# EAGLE design radioboard (EAGLE 8.1.0)
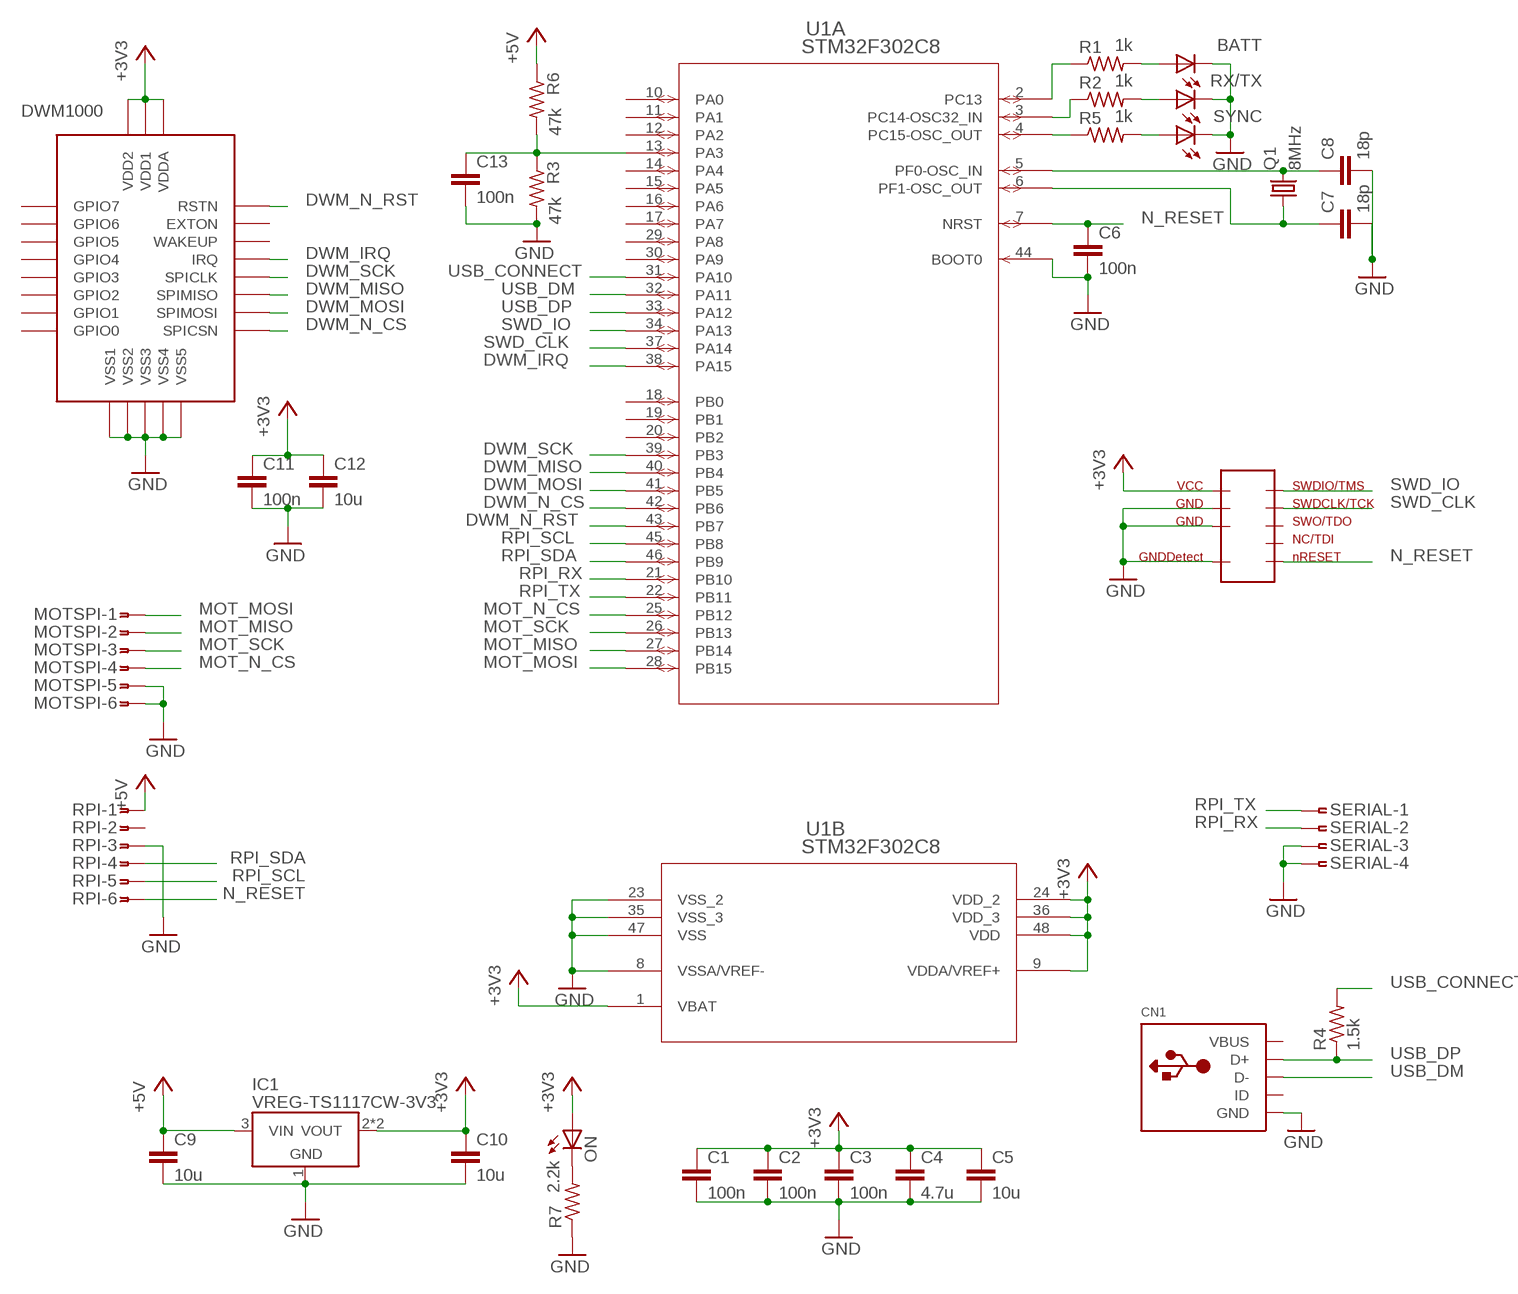
[diagram p0: schematic, sheet 1]

## Parts
BATT  LEDCHIPLED_0805  [CHIPLED_0805]
C1  100n  C-EUC0805  [C0805]
C2  100n  C-EUC0805  [C0805]
C3  100n  C-EUC0805  [C0805]
C4  4.7u  C-EUC0805  [C0805]
C5  10u  C-EUC0805  [C0805]
C6  100n  C-EUC0805  [C0805]
C7  18p  C-EUC0805  [C0805]
C8  18p  C-EUC0805  [C0805]
C9  10u  C-EUC0805  [C0805]
C10  10u  C-EUC0805  [C0805]
C11  100n  C-EUC0805  [C0805]
C12  10u  C-EUC0805  [C0805]
C13  100n  C-EUC0805  [C0805]
CN1  USBMINIB  [USB-MINIB]
DWM1000  DWM1000  [DW1000-PACKAGE]
IC1  VREG-TS1117CW-3V3  [SOT223]
MOTSPI  SMDTOP-6  [SMDTOP6]
ON  LEDCHIPLED_0805  [CHIPLED_0805]
Q1  8MHz  CRYSTALSM49  [SM49]
R1  1k  R-US_M0805  [M0805]
R2  1k  R-US_M0805  [M0805]
R3  47k  R-US_M0805  [M0805]
R4  1.5k  R-US_M0805  [M0805]
R5  1k  R-US_M0805  [M0805]
R6  47k  R-US_M0805  [M0805]
R7  2.2k  R-US_M0805  [M0805]
RPI  SMDTOP-6  [SMDTOP6]
RX/TX  LEDCHIPLED_0805  [CHIPLED_0805]
SERIAL  SMDTOP-4  [SMDTOP4]
SYNC  LEDCHIPLED_0805  [CHIPLED_0805]
U1  STM32F302C8  STM32F302_303C2  [LQFP48-7X7MM]
U$1  SWD/JTAG-_PINS  [SAMTEC_SHF-105-01-L-D-SM]

## Nets
+3V3: C1.1 C2.1 C3.1 C4.1 C5.1 C10.1 C11.1 C12.1 DWM1000.VDD3V3(VDD1) DWM1000.VDD3V32(VDD2) DWM1000.VDDAON(VDDA) IC1.2(VOUT) IC1.4(VOUT) ON.A U1.1(B:VBAT) U1.9(B:VDDA/VREF+) U1.24(B:VDD_2) U1.36(B:VDD_3) U1.48(B:VDD) U$1.P$1
+5V: C9.1 IC1.3(VIN) R6.1 RPI.1
DWM_IRQ: DWM1000.IRQ U1.38(A:PA15)
DWM_MISO: DWM1000.SPIMISO U1.40(A:PB4)
DWM_MOSI: DWM1000.SPIMOSI U1.41(A:PB5)
DWM_N_CS: DWM1000.SPICSN U1.42(A:PB6)
DWM_N_RST: DWM1000.RSTN U1.43(A:PB7)
DWM_SCK: DWM1000.SPICLK U1.39(A:PB3)
GND: BATT.C C1.2 C2.2 C3.2 C4.2 C5.2 C6.2 C7.2 C8.2 C9.2 C10.2 C11.2 C12.2 C13.2 CN1.GND DWM1000.VSS1 DWM1000.VSS2 DWM1000.VSS3 DWM1000.VSS4 DWM1000.VSS5 IC1.1(GND) MOTSPI.5 MOTSPI.6 R3.2 R7.1 RPI.3 RX/TX.C SERIAL.3 SERIAL.4 SYNC.C U1.8(B:VSSA/VREF-) U1.23(B:VSS_2) U1.35(B:VSS_3) U1.44(A:BOOT0) U1.47(B:VSS) U$1.P$3 U$1.P$5 U$1.P$9
MOT_MISO: MOTSPI.2 U1.27(A:PB14)
MOT_MOSI: MOTSPI.1 U1.28(A:PB15)
MOT_N_CS: MOTSPI.4 U1.25(A:PB12)
MOT_SCK: MOTSPI.3 U1.26(A:PB13)
N$1: R1.1 U1.2(A:PC13)
N$2: C7.1 Q1.1 U1.6(A:PF1-OSC_OUT)
N$3: C8.1 Q1.2 U1.5(A:PF0-OSC_IN)
N$4: R2.1 U1.3(A:PC14-OSC32_IN)
N$5: R5.1 U1.4(A:PC15-OSC_OUT)
N$6: BATT.A R1.2
N$7: R2.2 RX/TX.A
N$8: C13.1 R3.1 R6.2 U1.13(A:PA3)
N$9: ON.C R7.2
N$10: R5.2 SYNC.A
N_RESET: C6.1 RPI.6 U1.7(A:NRST) U$1.P$10
RPI_RX: SERIAL.2 U1.21(A:PB10)
RPI_SCL: RPI.5 U1.45(A:PB8)
RPI_SDA: RPI.4 U1.46(A:PB9)
RPI_TX: SERIAL.1 U1.22(A:PB11)
SWD_CLK: U1.37(A:PA14) U$1.P$4
SWD_IO: U1.34(A:PA13) U$1.P$2
USB_CONNECT: R4.2 U1.31(A:PA10)
USB_DM: CN1.D- U1.32(A:PA11)
USB_DP: CN1.D+ R4.1 U1.33(A:PA12)
Unconnected: CN1.ID DWM1000.EXTON DWM1000.GPIO0 DWM1000.GPIO1 DWM1000.GPIO2 DWM1000.GPIO3 DWM1000.GPIO4 DWM1000.GPIO5 DWM1000.GPIO6 DWM1000.GPIO7 DWM1000.WAKEUP RPI.2 U1.10(A:PA0) U1.11(A:PA1) U1.12(A:PA2) U1.14(A:PA4) U1.15(A:PA5) U1.16(A:PA6) U1.17(A:PA7) U1.18(A:PB0) U1.19(A:PB1) U1.20(A:PB2) U1.29(A:PA8) U1.30(A:PA9) U$1.P$6 U$1.P$8

## Power pins joined to a net without a drawn wire
VBUS: CN1.VBUS

## Library data of the parts
BATT ON RX/TX SYNC = misc:LED: LED OSRAM: - CHIPLED LG R971, LG N971, LY N971, LG Q971, LY Q971, LO R971, LY R971 LH N974, LH R974 LS Q976, LO Q976, LY Q976 LO Q996 - Hyper CHIPLED LW Q18S LB Q993, LB Q99A, LB R99A - SideLED LS A670, LO A670, LY A670, LG A670, LP A670 LB A673, LV A673, LT A673, LW A673 LH A674 LY A675 LS A676, LA A676, LO A676, LY A676, LW A676 LS A679, LY A679, LG A679 - Hyper Micro SIDELED® LS Y876, LA Y876, LO Y876, LY Y876 LT Y87S - SmartLED LW L88C, LW L88S LB L89C, LB L89S, LG L890 LS L89K, LO L89K, LY L89K LS L896, LA L896, LO L896, LY L896 - TOPLED LS T670, LO T670, LY T670, LG T670, LP T670 LSG T670, LSP T670, LSY T670, LOP T670, LYG T670 LG T671, LOG T671, LSG T671 LB T673, LV T673, LT T673, LW T673 LH T674 LS T676, LA T676, LO T676, LY T676, LB T676, LH T676, LSB T676, LW T676 LB T67C, LV T67C, LT T67C, LS T67K, LO T67K, LY T67K, LW E67C LS E67B, LA E67B, LO E67B, LY E67B, LB E67C, LV E67C, LT E67C LW T67C LS T679, LY T679, LG T679 LS T770, LO T770, LY T770, LG T770, LP T770 LB T773, LV T773, LT T773, LW T773 LH T774 LS E675, LA E675, LY E675, LS T675 LS T776, LA T776, LO T776, LY T776, LB T776 LHGB T686 LT T68C, LB T68C - Hyper Mini TOPLED® LB M676 - Mini TOPLED Santana® LG M470 LS M47K, LO M47K, LY M47K Source: http://www.osram.convergy.de/
C1-C13 = rcl:C-EU: CAPACITOR, European symbol
CN1 = misc:USB: USB Connectors USBMINIB - Surface Mount Female Mini-B USB Connector 4UConnector: 06564 By microbuilder.eu Thru-hole RA Female Mini-B USB Connector 4UConnector: 18732 By ladyada.net
DWM1000 = DWM1000:DWM1000
IC1 = we-power:VREG: Voltage Regulators (LDOs, Switching Converters...) LDOs Taiwan Semi TS1117 800mA max 15V - compatible On Semi NCP1117 1A max 20V - compatible Diodes AP2111H 0.6A max 6V (0.25V@0.6A) - compatible Diodes AP2114H 1A max 6V (0.45V@1A) Taiwan Semi TS9011 250mA max 12V - compatible Diodes AP2210 300mA max 15V - compatible Microchip MCP1700 250mA max 6.5V - compatible Microchip MCP1702 250mA max 13V - compatible Microchip MCP1703 250mA max 16V - compatible Microchip MCP1754 150mA max 16V Taiwan Semi TS5204 150mA max 16V (low noise) DC/DC Converter Modules Recom R-78Ex.x-1.0-W36 1A max 28V - compatible CUI V78xx-2000 2A max 18V Murata OKI-78SR-x.x/1.5-W36 1.5A max 36V
MOTSPI RPI = con-amp:SMDTOP-6: AMP connector
Q1 = crystal:CRYSTAL: CRYSTAL; OC_FARNELL: unknown; OC_NEWARK: unknown
R1-R7 = rcl:R-US_: RESISTOR, American symbol
SERIAL = con-amp:SMDTOP-4: AMP connector
U1 = STM32F3xx:STM32F302_303C2; COPYRIGHT: Copyright C 2016 Accelerated Designs. All rights reserved; MANUFACTURER_PART_NUMBER: stm32f302_303c2; VENDOR: STMicroelectronics
U$1 = con-SWD:SWD/JTAG-_PINS

## Board
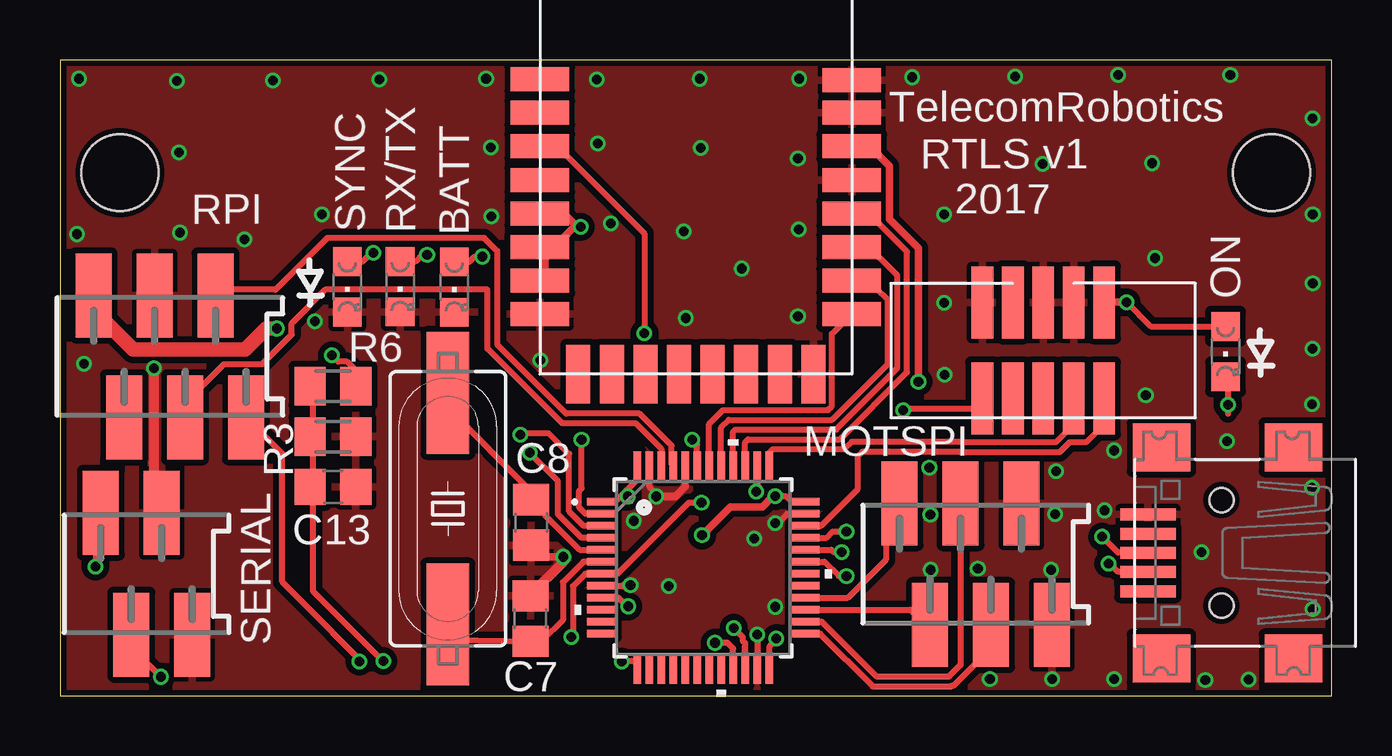
[diagram p1: board, top side]
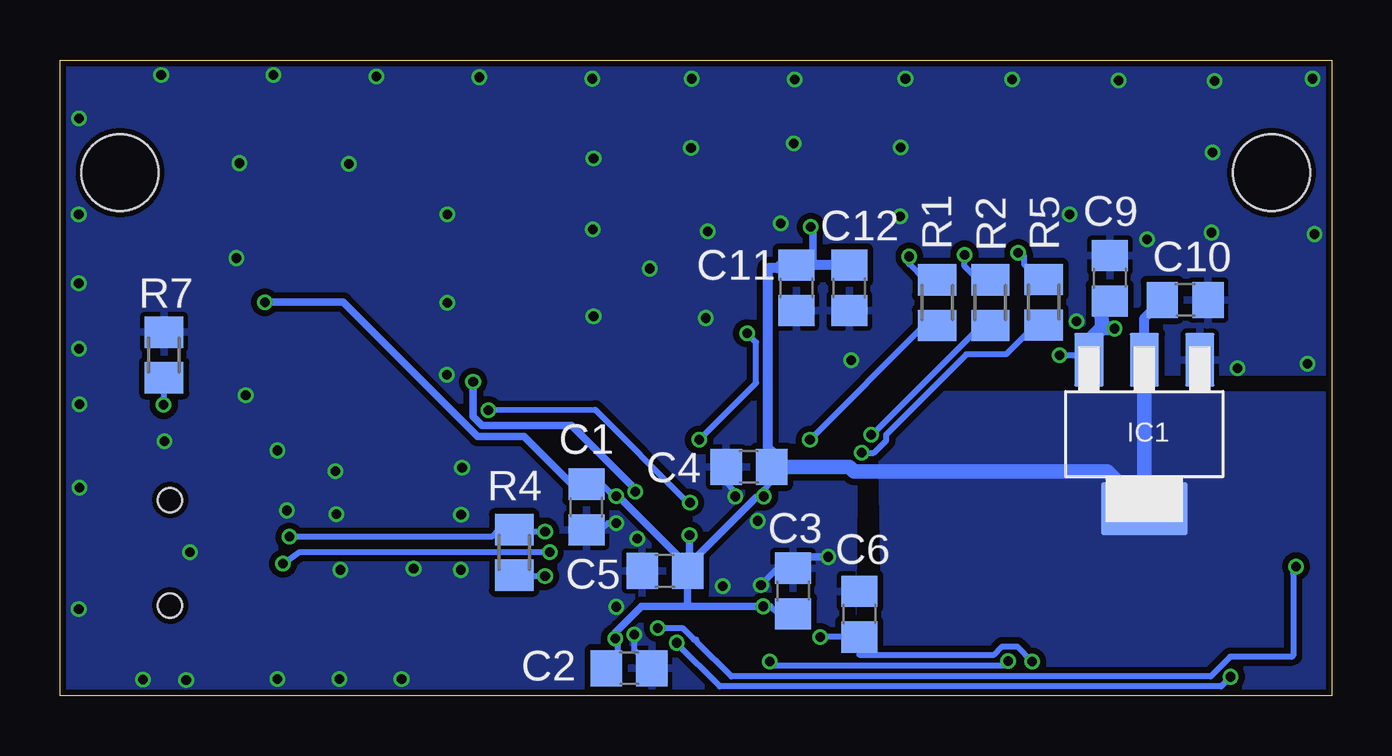
[diagram p2: board, bottom side, seen from below]

Size 53 x 26.5 mm. Coordinates in mm from the lower left corner, seen from the top.
Outline: 0,0 53,0 53,26.5 0,26.5 0,0
Copper layers (1*16): Top 0.018mm / dielectric 1.55mm / Bottom 0.018mm
Design rules "eurocircuit": minimum track width 0.15mm, minimum drill 0.35mm, track to track 0.15mm, track to pad 0.15mm, pad to pad 0.15mm, via to via 0.15mm, smd to smd 0mil, copper to edge 0.25mm, drill to drill 0.35mm, minimum pad ring 0.175mm, minimum via ring 0.125mm, stop-mask expansion 0mil, vias tented up to drill 0.45mm, thermal gap 0.2mm
Holes 3.2 mm at 2.5,21.8 50.5,21.8

### Footprints (pad centres in the part's own frame; a part is rotated, then mirrored left to right if it is on the bottom)
CHIPLED_0805 = smd 1.2 x 1.2: A 0,-1.05; C 0,1.05
C0805 = smd 1.3 x 1.5: 1 -0.95,0; 2 0.95,0
USB-MINIB = smd 0.5 x 2.308: D+ 0,4.064; D- -0.8,4.064; GND 1.6,4.064; ID 0.8,4.064; VBUS -1.6,4.064 | smd 2 x 2.4: GND1 -4.4,-2; GND2 -4.4,3.5; GND3 4.4,3.5; GND4 4.4,-2 | hole 1: -2.2,1; 2.2,1
DW1000-PACKAGE = smd 2.45 x 1: EXTON -6.5,-0.7; GPIO7 -6.5,-4.9; IRQ 6.5,-3.5; RSTN -6.5,-3.5; SPICLK 6.5,-6.3; SPICSN 6.5,-10.5; SPIMISO 6.5,-7.7; SPIMOSI 6.5,-9.1; VDD3V3 -6.5,-7.7; VDD3V32 -6.5,-9.1; VDDAON -6.5,-6.3; VSS1 -6.5,-10.5; VSS3 6.5,-4.9; VSS4 6.5,-2.1; VSS5 6.5,-0.75; WAKEUP -6.5,-2.1 | smd 1 x 2.45: GPIO0 3.5,-13; GPIO1 2.1,-13; GPIO2 0.7,-13; GPIO3 -0.7,-13; GPIO4 -2.1,-13; GPIO5 -3.5,-13; GPIO6 -4.9,-13; VSS2 4.9,-13
SOT223 = smd 2.235 x 1.219: 1 -3.099,2.311; 2 -3.099,0; 3 -3.099,-2.311 | smd 2.2 x 3.6: 4 3.099,0
SMDTOP6 = smd 1.5 x 3.5: 1 -3.175,2.54; 2 -1.905,-2.54; 3 -0.635,2.54; 4 0.635,-2.54; 5 1.905,2.54; 6 3.175,-2.54
SM49 = smd 5.08 x 1.778: 1 -4.826,0; 2 4.826,0
M0805 = smd 1.3 x 1.6: 1 -0.95,0; 2 0.95,0
SMDTOP4 = smd 1.5 x 3.5: 1 -1.905,2.54; 2 -0.635,-2.54; 3 0.635,2.54; 4 1.905,-2.54
LQFP48-7X7MM = smd 1.194 x 0.305: 1 -4.25,2.75; 2 -4.25,2.25; 3 -4.25,1.75; 4 -4.25,1.25; 5 -4.25,0.75; 6 -4.25,0.25; 7 -4.25,-0.25; 8 -4.25,-0.75; 9 -4.25,-1.25; 10 -4.25,-1.75; 11 -4.25,-2.25; 12 -4.25,-2.75; 25 4.25,-2.75; 26 4.25,-2.25; 27 4.25,-1.75; 28 4.25,-1.25; 29 4.25,-0.75; 30 4.25,-0.25; 31 4.25,0.25; 32 4.25,0.75; 33 4.25,1.25; 34 4.25,1.75; 35 4.25,2.25; 36 4.25,2.75 | smd 0.305 x 1.194: 13 -2.75,-4.25; 14 -2.25,-4.25; 15 -1.75,-4.25; 16 -1.25,-4.25; 17 -0.75,-4.25; 18 -0.25,-4.25; 19 0.25,-4.25; 20 0.75,-4.25; 21 1.25,-4.25; 22 1.75,-4.25; 23 2.25,-4.25; 24 2.75,-4.25; 37 2.75,4.25; 38 2.25,4.25; 39 1.75,4.25; 40 1.25,4.25; 41 0.75,4.25; 42 0.25,4.25; 43 -0.25,4.25; 44 -0.75,4.25; 45 -1.25,4.25; 46 -1.75,4.25; 47 -2.25,4.25; 48 -2.75,4.25
SAMTEC_SHF-105-01-L-D-SM = smd 3 x 0.914: P$1 -2,2.54; P$2 2,2.54; P$3 -2,1.27; P$4 2,1.27; P$5 -2,0; P$6 2,0; P$7 -2,-1.27; P$8 2,-1.27; P$9 -2,-2.54; P$10 2,-2.54

### Placement (x,y rotation side)
BATT  16.44,17.03 180 top
C1  31.06,7.86 270 bottom
C2  29.28,1.14 0 bottom
C3  22.44,4.36 90 bottom
C4  24.28,9.54 180 bottom
C5  27.78,5.2 180 bottom
C6  19.68,3.39 90 bottom
C7  19.61,3.21 90 top
C8  19.64,7.22 270 top
C9  9.24,17.4 90 bottom
C10  6.1,16.5 0 bottom
C11  22.3,17 270 bottom
C12  20.1,17 270 bottom
C13  11.38,8.7 0 top
CN1  49.41,5.95 90 top
DWM1000  26.5,26.4 0 top
IC1  7.8,10.9 270 bottom
MOTSPI  38.17,5.48 0 top
ON  48.58,14.34 180 top
Q1  16.17,7.79 90 top
R1  16.44,16.38 90 bottom
R2  14.22,16.38 90 bottom
R3  11.38,10.8 0 top
R4  34.07,5.97 270 bottom
R5  12,16.4 90 bottom
R6  11.38,12.9 180 top
R7  48.66,14.2 270 bottom
RPI  4.58,14.14 0 top
RX/TX  14.18,17.05 180 top
SERIAL  3.61,5.08 0 top
SYNC  11.98,17.04 180 top
U1  26.81,5.33 0 top
U$1  40.98,14.39 270 top

### Tracks (layer width: path | path; a pad name or v marks a point on that pad's centre or on a via)
+3V3  (via drill 0.4)
  Top 0.254: U1.36 30.5,8.08 30.26,8.32 v29.82,8.32 | U1.24 29.58,1.56 29.58,2.06 v29.86,2.38 | U1.9 23.28,4.08 23.64,3.72 v23.68,3.72 | U1.1 23.16,8.08 23.52,8.44 | 23.52,8.44 24.06,8.98 U1.48 | v23.66,8.3 23.52,8.44 | v44.46,16.4 45.47,15.39 ON.A
  Top 0.305: DWM1000.VDDAON 21.02,20.1 21.58,19.54 v21.7,19.54 21.4,19.52 20.58,18.7 DWM1000.VDD3V3 20.22,18.56 20.22,17.32 20.2,17.3 DWM1000.VDD3V32 | v44.46,16.4 U$1.P$1 | v26.76,6.68 27.95,7.87 29.28,7.87 29.73,8.32 v29.82,8.32
  Bottom 0.254: v29.82,8.32 29.92,8.32 30.42,8.82 C1.1 | v29.86,2.38 29.74,2.28 29.74,1.56 C2.1 | v23.68,3.72 23.38,3.72 23.08,3.42 C3.1 | v23.66,8.3 23.66,8.58 23.34,8.9 C4.1
  Bottom 0.305: v29.86,2.38 29.87,2.61 29.69,2.8 28.77,3.72 26.84,3.72 | v23.68,3.72 26.84,3.72 | C11.1 21.62,18.16 21.62,19.54 v21.7,19.54 | v44.46,16.4 41.2,16.4 35.6,10.8 33.66,10.8 31.68,8.82 31.18,8.82 C1.1 | 26.84,3.72 C5.1 | v29.82,8.32 29.7,8.28 27.14,5.72 26.86,5.72 26.84,5.7 26.84,5.34 C5.1 | v23.66,8.3 23.78,8.26 24,8.26 26.5,5.76 26.7,5.76 C5.1 | C5.1 26.76,5.2 v26.76,6.68
  Bottom 0.406: IC1.2 7.8,15.75 C10.1 | C4.1 23.34,9.84 23.34,10.18 23.48,10.32 23.48,17.82 23.08,17.82 22.94,17.96 C11.1 22.1,17.96 C12.1
  Bottom 0.61: IC1.2 IC1.4 9.34,9.34 19.9,9.34 20.1,9.54 C4.1
  pour Bottom (isolate 0.254, no thermals): 0.36,12.56 15.76,12.6 18.84,12.58 18.6,0.22 18.42,0.04 0.1,0.04 0.02,0.12 0.02,12.24 0.36,12.58
+5V  (via drill 0.4)
  Top 0.254: R6.1 12.46,12.9 12.46,13.42 11.96,13.92 11.6,13.92 v11.34,14.18
  Top 0.61: RPI.1 1.4,16.08 3.06,14.42 7.72,14.42 8.6,15.3 v9.04,15.3
  Bottom 0.254: v11.34,14.18 10.14,14.18 10.12,14.16 IC1.3
  Bottom 0.61: 9.58,15.32 10.14,14.76 IC1.3 | 9.58,15.32 9.6,16.12 9.44,16.46 9.6,16.46 C9.1 | 9.58,15.32 v9.04,15.3
DWM_IRQ  (via drill 0.4)
  Top 0.305: U1.38 29.06,8.54 v29.02,8.5 | v35.78,13.08 35.78,18.66 34.58,19.86 34.58,22.08 33.76,22.9 DWM1000.IRQ
  Bottom 0.305: v29.02,8.5 29.02,8.6 31.68,11.26 35.4,11.26 35.78,11.64 v35.78,13.08
DWM_MISO
  Top 0.254: U1.40 28.06,11 28.15,11.09 32.35,11.09 34.91,13.65 34.91,17.51 33.84,18.58 33.84,18.64 33.06,18.64 DWM1000.SPIMISO
DWM_MOSI
  Top 0.254: U1.41 27.56,11.17 27.88,11.49 32.18,11.49 34.5,13.81 34.5,16.52 34.02,17 34.02,17.04 33.26,17.04 DWM1000.SPIMOSI
DWM_N_CS
  Top 0.254: U1.42 27.06,11.32 27.64,11.9 32.02,11.9 32.18,12.06 32.18,15.08 DWM1000.SPICSN
DWM_N_RST  (via drill 0.4)
  Top 0.254: v26.36,10.66 26.56,10.46 U1.43 | v24.36,15.1 24.36,19.26 20.72,22.9 DWM1000.RSTN
  Bottom 0.254: v24.36,15.1 23.98,14.72 23.98,13.04 v26.36,10.66
DWM_SCK
  Top 0.254: U1.39 28.56,10.56 28.69,10.69 32.52,10.69 35.31,13.48 35.31,18.51 34.28,19.54 33.72,20.1 DWM1000.SPICLK
GND  (via drill 0.4)
  Top 0.254: U1.35 30.32,7.58 29.92,7.18 v29.82,7.18 | U1.23 29.08,2.24 v29.06,2.54 | U1.8 23.44,4.58 v23.78,4.6 23.74,4.6 | v24.86,8.3 24.86,8.4 24.56,8.7 U1.47
  Top 0.305: 20.98,5.58 v20.98,5.78 20.13,5.78 C8.2 | U1.44 26.06,8.71 25.66,8.3 v24.86,8.3 | C7.2 19.61,4.21
  Top 0.406: 19.61,4.21 20.98,5.58 | SERIAL.3 3.92,7.95 v3.92,13.64
  Bottom 0.254: v29.82,7.18 30.16,7.18 30.42,6.92 C1.2 | v29.06,2.54 29.06,1.88 C2.2 | v23.78,4.6 23.58,4.82 23.08,5.32 C3.2 | v24.86,8.3 24.86,8.52 25.24,8.9 C4.2
  Bottom 0.305: v20.98,5.78 21.98,5.78 C3.2
  other vias: 28.94,6.54 23.92,7.28 20.02,13.98 22.96,19.68 26.08,15.74 30.76,15.82 1,13.84 25.38,4.56 29.82,3.7 38.76,0.68 41.36,0.68 43.94,0.68 41.32,5.24 38.26,5.3 36.3,5.24 36.28,7.54 36.24,9.5 36.88,13.38 36.86,16.38 36.86,20.06 45.52,22.2 47.74,0.64 49.54,0.66 52.22,3.6 52.18,8.66 47.58,5.98 52.2,24.06 48.64,10.6 41.48,7.56 41.52,9.36 43.94,10.22 43.54,7.72 52.18,12.14 52.2,14.46 52.22,17.18 52.22,20.06 26,19.36 22.42,23.02 22.38,25.68 26.66,25.72 30.82,25.72 30.76,22.4 30.8,19.44 26.7,22.84 28.42,17.8 0.7,19.24 0.8,25.72 17.76,25.72 17.98,19.98 7.68,19.02 5,19.3 4.88,25.62 8.88,25.64 13.32,25.68 10.92,20.06 4.96,22.64 17.96,22.86 35.52,25.78 39.82,25.82 44.1,25.88 48.78,25.88 40.96,22.16 45.26,12.52 45.64,18.24 10.62,15.6
  pour Bottom (isolate 0.254): -0.1,26.76 -0.1,13.48 17.18,13.48 19.22,13.44 19.86,12.88 19.98,-0.2 20,-0.22 53.3,-0.22 53.3,26.76
  pour Top (isolate 0.254): -0.26,26.66 53.2,26.66 53.2,-0.32 -0.26,-0.32
MOT_MISO
  Top 0.254: U1.27 35.44,3.58 36.22,2.8 36.22,2.6 MOTSPI.2
MOT_MOSI
  Top 0.254: U1.28 32.84,4.08 34.42,5.66 34.42,6.5 34.96,7.04 34.96,7.68 MOTSPI.1
MOT_N_CS
  Top 0.254: 38.76,2 38.76,2.6 MOTSPI.4 38.72,1.88 37.26,0.42 37.14,0.38 33.88,0.38 31.68,2.58 U1.25
MOT_SCK
  Top 0.254: U1.26 31.76,3.08 34.04,0.8 37.06,0.8 37.54,1.28 MOTSPI.3
N$1  (via drill 0.4)
  Top 0.254: v21.74,10.66 21.74,8.64 21.64,8.54 21.64,7.84 21.9,7.58 U1.2
  Bottom 0.254: v21.74,10.66 16.96,15.44 R1.1
N$2
  Top 0.254: Q1.1 16.18,2.46 16.32,2.32 C7.1 20.14,2.32 20.96,3.14 20.96,4.72 21.82,5.58 U1.6
N$3
  Top 0.254: U1.5 21.66,6.08 20.2,7.54 20.2,8.16 20.18,8.18 C8.1 19.6,8.3 19.6,8.56 16.18,11.98 16.18,12.6 Q1.2
N$4  (via drill 0.4)
  Top 0.254: U1.3 21.82,7.08 21.22,7.68 21.22,10.08 20.36,10.94 19.24,10.94 v19.18,10.88
  Bottom 0.254: v19.18,10.88 19.14,10.88 14.74,15.28 14.74,15.42 14.72,15.44 R2.1
N$5  (via drill 0.4)
  Top 0.254: U1.4 21.74,6.58 20.76,7.56 20.76,8.94 v19.58,10.12
  Bottom 0.254: 12.52,15.28 12.52,15.44 12.5,15.46 R5.1 12.6,15.2 13.58,14.22 15.22,14.22 18.56,10.88 18.56,10.64 19.08,10.12 v19.58,10.12
N$6  (via drill 0.4)
  Top 0.254: BATT.A 17.06,18.08 17.28,18.3 v17.6,18.3
  Bottom 0.254: v17.6,18.3 17.6,17.98 16.96,17.34 R1.2
N$7  (via drill 0.4)
  Top 0.254: RX/TX.A 14.82,18.1 15.12,18.4 15.3,18.4 v15.3,18.38
  Bottom 0.254: v15.3,18.38 15.3,17.9 14.74,17.34 R2.2
N$8  (via drill 0.4)
  Top 0.254: R6.2 10.56,12.9 10.56,10.8 R3.1 10.56,10.68 10.56,8.7 C13.1 10.56,8.58 10.56,4.34 13.4,1.48 v13.48,1.44 13.5,1.32 | v23.42,1.42 24.04,1.42 24.06,1.4 U1.13
  Bottom 0.254: v23.42,1.42 23.22,1.26 13.6,1.26 v13.48,1.44 13.5,1.36
N$9  (via drill 0.4)
  Top 0.254: ON.C 48.68,13.3 v48.68,12.12 48.68,11.76
  Bottom 0.254: v48.68,12.12 48.68,13.26 R7.2
N$10  (via drill 0.4)
  Top 0.254: v13.06,18.46 12.98,18.46 12.62,18.1 SYNC.A
  Bottom 0.254: 12.86,18.46 v13.06,18.46 12.82,18.34 12.82,17.98 12.2,17.36 R5.2
N_RESET  (via drill 0.4)
  Top 0.254: v21.32,2.44 21.38,2.5 21.38,4.56 21.9,5.08 U1.7 23.24,5.08 26.2,8.04 v26.74,8.04 | U$1.P$10 38.44,11.96 38.42,11.94 35.26,11.94 v35.14,11.9 | RPI.6 9.26,10.09 9.26,4.75 10.15,3.85 12.56,1.44 v12.48,1.42
  Bottom 0.254: 21.34,2.44 v21.32,2.44 C6.1 19.68,1.7 14.07,1.7 13.73,2.04 13.1,2.04 v12.48,1.42 12.49,1.38 | v35.14,11.9 30.7,11.92 26.88,8.1 v26.74,8.04
RPI_RX  (via drill 0.4)
  Top 0.254: U1.21 28.06,1.96 27.82,2.2 v27.3,2.2 | v4.2,0.78 2.98,2 SERIAL.2
  Bottom 0.254: v4.2,0.78 4.6,0.38 25.5,0.38 27.3,2.18 v27.3,2.2
RPI_SCL
  Top 0.254: 6.48,16.88 RPI.5 6.6,16.92 8.98,16.92 11.14,19.08 17.68,19.08 18.22,18.54 18.22,17.09 18.22,14.64 21.1,11.76 24.15,11.76 25.49,10.42 25.5,10.41 25.5,9.64 U1.45
RPI_SDA
  Top 0.254: 5.22,12.2 RPI.4 5.3,12.28 6.84,13.82 8.42,13.82 9.66,15.06 9.66,15.52 11.06,16.92 17.82,16.92 17.82,14.47 20.93,11.36 23.98,11.36 25.07,10.27 25.07,9.63 U1.46
RPI_TX  (via drill 0.4)
  Top 0.254: 28.56,2.08 U1.22 28.56,2.19 28.46,2.29 28.46,2.44 v28.08,2.82 | v1.48,5.38 1.48,6.78 1.66,6.96 SERIAL.1
  Bottom 0.254: v28.08,2.82 27.06,2.82 26.58,2.34 26.48,2.34 26.44,2.22 25.02,0.8 5.04,0.8 4.22,1.62 1.72,1.62 1.6,1.66 1.6,5.08 1.52,5.16 v1.48,5.38 1.48,5.28
SWD_CLK
  Top 0.254: U1.37 29.56,10.12 29.72,10.28 32.7,10.28 33,10.58 37.66,10.58 37.68,10.56 41.5,10.56 42.26,11.32 U$1.P$4
SWD_IO
  Top 0.254: U1.34 31.72,7.08 33.26,8.62 33.26,9.98 33.44,10.16 37.5,10.16 37.52,10.14 41.66,10.14 42.08,10.56 42.78,10.56 43.52,11.3 U$1.P$2
USB_CONNECT  (via drill 0.4)
  Top 0.254: U1.31 31.86,5.58 32.46,4.98 v32.78,4.98
  Bottom 0.254: v32.78,4.98 33.4,4.98 33.44,5.02 R4.2
USB_DM  (via drill 0.4)
  Top 0.254: U1.32 32.14,6.08 32.26,5.98 v32.58,5.98 | v43.7,5.5 43.76,5.5 44.1,5.16 CN1.D-
  Bottom 0.254: v32.58,5.98 43.02,5.98 v43.7,5.5
USB_DP  (via drill 0.4)
  Top 0.254: v32.78,6.84 32.2,6.84 31.94,6.58 U1.33 | v43.44,6.62 44.1,5.96 CN1.D+
  Bottom 0.254: v32.78,6.84 33.36,6.84 33.44,6.92 R4.1 34.7,6.92 35,6.62 v43.44,6.62

### Text on the board
tNames: TelecomRobotics | RTLS v1 | 2017